# EAGLE design uBraids_SE_Main_Board (EAGLE 9.5.2)

## Sheet 1 of 2
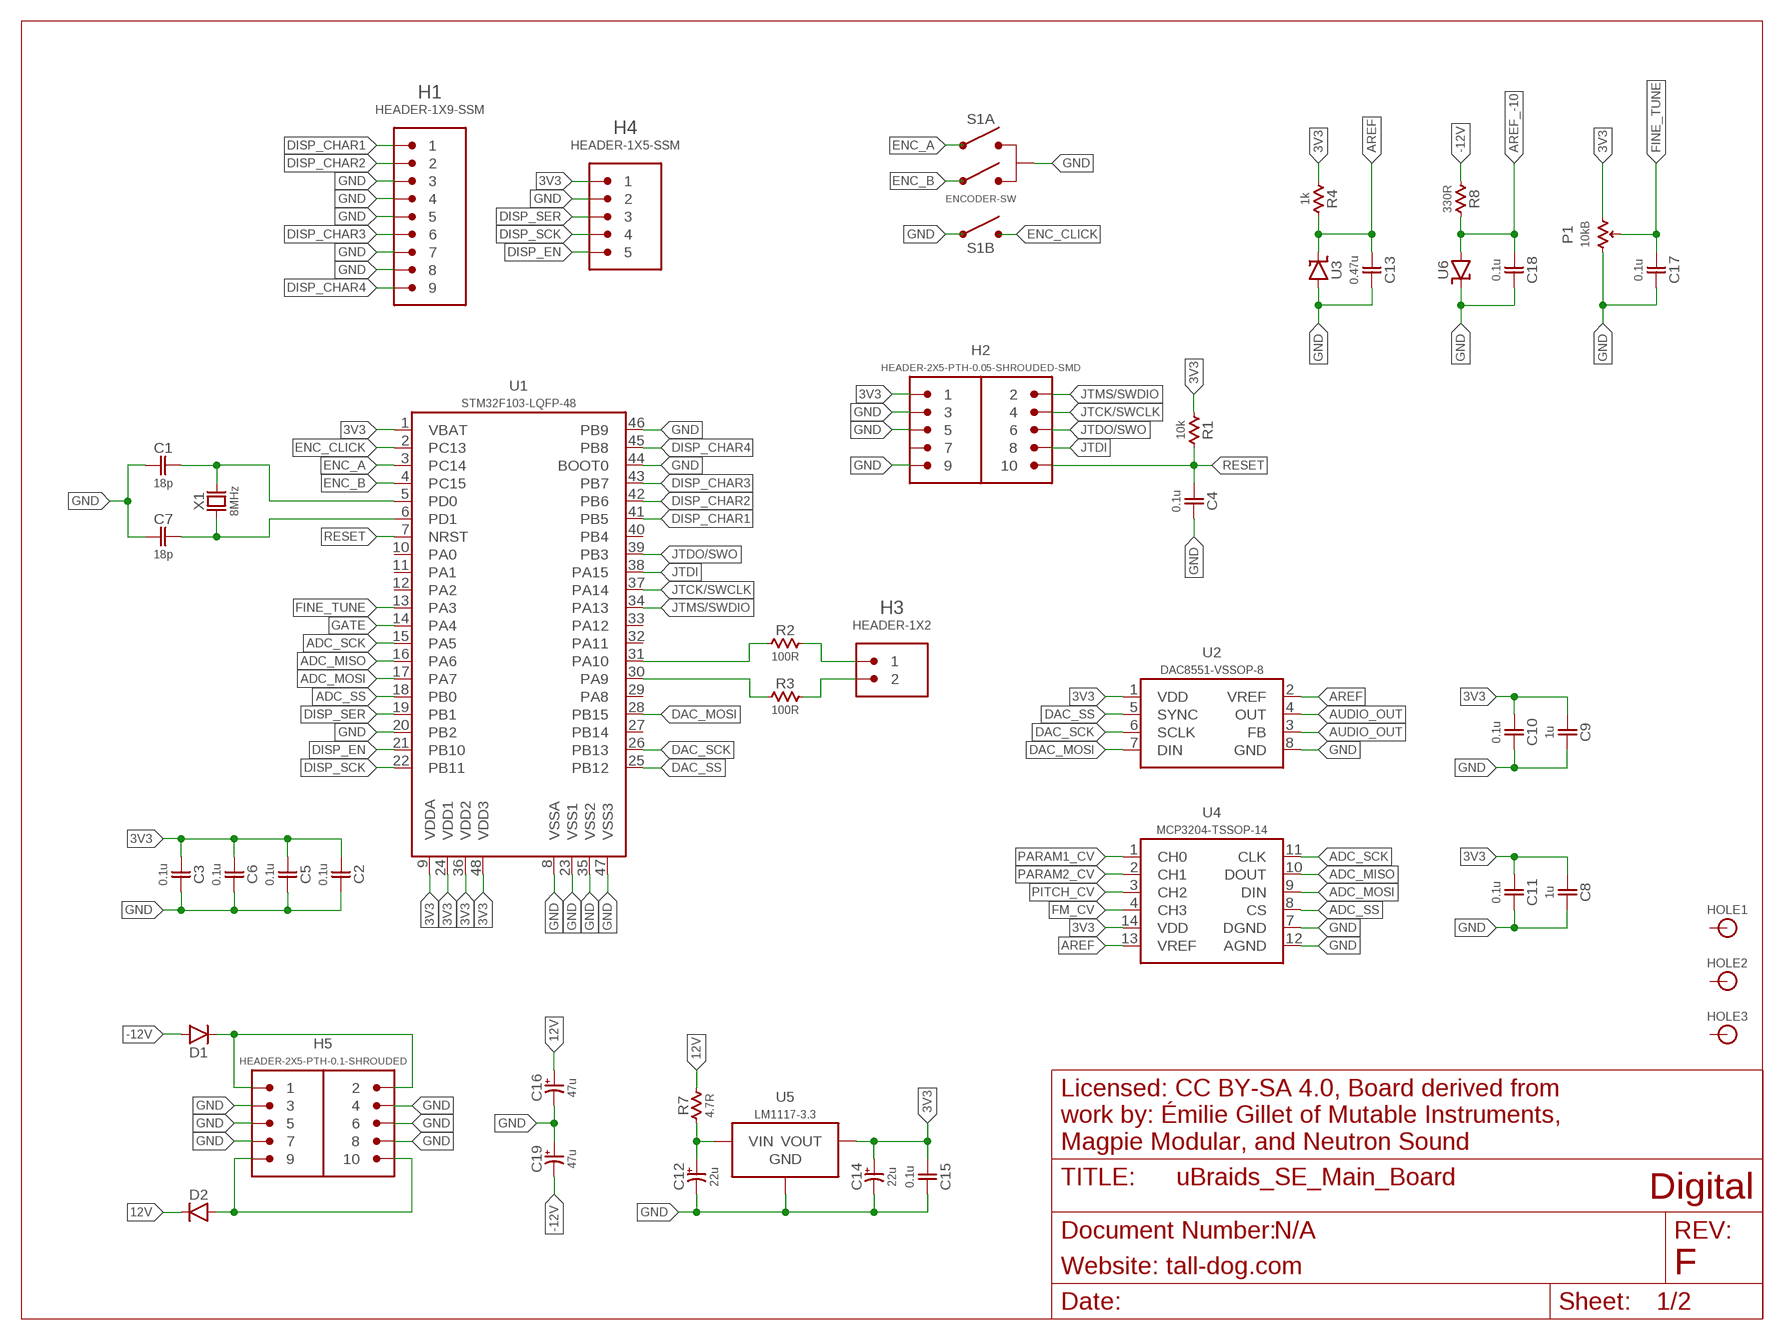
[diagram p0: schematic, sheet 1]

### Parts
C1  18p  CAP-NP-0603  [0603-NP]
C2  0.1u  CAP-NP-0603  [0603-NP]
C3  0.1u  CAP-NP-0603  [0603-NP]
C4  0.1u  CAP-NP-0603  [0603-NP]
C5  0.1u  CAP-NP-0603  [0603-NP]
C6  0.1u  CAP-NP-0603  [0603-NP]
C7  18p  CAP-NP-0603  [0603-NP]
C8  1u  CAP-NP-0603  [0603-NP]
C9  1u  CAP-NP-0603  [0603-NP]
C10  0.1u  CAP-NP-0603  [0603-NP]
C11  0.1u  CAP-NP-0603  [0603-NP]
C12  22u  CAP-P-6.6MM  [ELECTRO-SMD-6.6MM]
C13  0.47u  CAP-NP-0603  [0603-NP]
C14  22u  CAP-P-6.6MM  [ELECTRO-SMD-6.6MM]
C15  0.1u  CAP-NP-0603  [0603-NP]
C16  47u  CAP-P-6.6MM  [ELECTRO-SMD-6.6MM]
C17  0.1u  CAP-NP-0603  [0603-NP]
C18  0.1u  CAP-NP-0603  [0603-NP]
C19  47u  CAP-P-6.6MM  [ELECTRO-SMD-6.6MM]
D1  1N5819HW  DIODE-SOD123  [SOD-123]
D2  1N5819HW  DIODE-SOD123  [SOD-123]
H1  HEADER-1X9-SSM  [SSM-109-S-SV-BE]
H2  HEADER-2X5-PTH-0.05-SHROUDED-SMD  [PTH-0.05-2X5-SHROUDED-SMD]
H3  HEADER-1X2  [PTH-0.1-1X2]
H4  HEADER-1X5-SSM  [SSM-105-S-SV-BE]
H5  HEADER-2X5-PTH-0.1-SHROUDED  [PTH-0.1-2X5-SHROUDED]
HOLE1  HOLE  [M2.5-HOLE]
HOLE2  HOLE  [M2.5-HOLE]
HOLE3  HOLE  [M2.5-HOLE]
P1  10kB  POT-ALPS-VERT-PS  [POT]
R1  10k  RESISTOR-0603  [0603-NP]
R2  100R  RESISTOR-0603  [0603-NP]
R3  100R  RESISTOR-0603  [0603-NP]
R4  1k  RESISTOR-0603  [0603-NP]
R7  4.7R  RESISTOR-0805  [0805-NP]
R8  330R  RESISTOR-0805  [0805-NP]
S1  ENCODER-SW  [ENCODER-EC12E]
U1  STM32F103-LQFP-48  [LQFP-48]
U2  DAC8551-VSSOP-8  [VSSOP-8]
U3  LM4040B25  LM4041-SOT-23  [SOT-23]
U4  MCP3204-TSSOP-14  [TSSOP-14]
U5  LM1117-3.3  LM1117-SOT-223  [SOT-223]
U6  LM4040B10  LM4041-SOT-23  [SOT-23]
X1  8MHz  CRYSTAL-ABM2  [CRYSTAL-ABM2]

### Nets
3V3: C2.1 C3.1 C5.1 C6.1 C8.1 C9.1 C10.1 C11.1 C14.A(POS) C15.1 H2.1 H4.1 P1.P$1(E) R1.1 R4.1 U1.1(VBAT) U1.9(VDDA) U1.24(VDD1) U1.36(VDD2) U1.48(VDD3) U2.1(VDD) U4.14(VDD) U5.2(VOUT) U5.4(VOUT) ; also sheet 2
12V: C16.A(POS) D2.C R7.2 ; also sheet 2
12V_BUS: D2.A H5.9 H5.10
12V_U5: C12.A(POS) R7.1 U5.3(VIN)
-12V: C19.C(NEG) D1.A R8.1 ; also sheet 2
-12V_BUS: D1.C H5.1 H5.2
ADC_MISO: U1.16(PA6) U4.10(DOUT)
ADC_MOSI: U1.17(PA7) U4.9(DIN)
ADC_SCK: U1.15(PA5) U4.11(CLK)
ADC_SS: U1.18(PB0) U4.8(CS)
AREF: C13.1 R4.2 U2.2(VREF) U3.1(C) U4.13(VREF)
AREF_-10: C18.1 R8.2 U6.2(A) ; also sheet 2
AUDIO_OUT: U2.3(FB) U2.4(OUT) ; also sheet 2
DAC_MOSI: U1.28(PB15) U2.7(DIN)
DAC_SCK: U1.26(PB13) U2.6(SCLK)
DAC_SS: U1.25(PB12) U2.5(SYNC)
DISP_CHAR1: H1.1 U1.41(PB5)
DISP_CHAR2: H1.2 U1.42(PB6)
DISP_CHAR3: H1.6 U1.43(PB7)
DISP_CHAR4: H1.9 U1.45(PB8)
DISP_EN: H4.5 U1.21(PB10)
DISP_SCK: H4.4 U1.22(PB11)
DISP_SER: H4.3 U1.19(PB1)
ENC_A: S1.B(A:B) U1.3(PC14)
ENC_B: S1.A(A:A) U1.4(PC15)
ENC_CLICK: S1.E U1.2(PC13)
FINE_TUNE: C17.1 P1.P$2(S) U1.13(PA3)
FM_CV: U4.4(CH3) ; also sheet 2
GATE: U1.14(PA4) ; also sheet 2
GND: C1.1 C2.2 C3.2 C4.2 C5.2 C6.2 C7.1 C8.2 C9.2 C10.2 C11.2 C12.C(NEG) C13.2 C14.C(NEG) C15.2 C16.C(NEG) C17.2 C18.2 C19.A(POS) H1.3 H1.4 H1.5 H1.7 H1.8 H2.3 H2.5 H2.9 H4.2 H5.3 H5.4 H5.5 H5.6 H5.7 H5.8 P1.P$3(A) S1.C(A:C) S1.D U1.8(VSSA) U1.20(PB2) U1.23(VSS1) U1.35(VSS2) U1.44(BOOT0) U1.46(PB9) U1.47(VSS3) U2.8(GND) U3.2(A) U4.7(DGND) U4.12(AGND) U5.1(GND) U6.1(C) ; also sheet 2
JTCK/SWCLK: H2.4 U1.37(PA14)
JTDI: H2.8 U1.38(PA15)
JTDO/SWO: H2.6 U1.39(PB3)
JTMS/SWDIO: H2.2 U1.34(PA13)
PARAM1_CV: U4.1(CH0) ; also sheet 2
PARAM2_CV: U4.2(CH1) ; also sheet 2
PD0-XTAL: C1.2 U1.5(PD0) X1.2
PD1-XTAL: C7.2 U1.6(PD1) X1.1
PITCH_CV: U4.3(CH2) ; also sheet 2
RESET: C4.1 H2.10 R1.2 U1.7(NRST)
RX: H3.1 R2.2
RX_R: R2.1 U1.31(PA10)
TX: H3.2 R3.2
TX_R: R3.1 U1.30(PA9)
Unconnected: H2.7 HOLE1.P$1 HOLE1.P$2 HOLE1.P$3 HOLE1.P$4 HOLE1.P$5 HOLE1.P$6 HOLE1.P$7 HOLE1.P$8 HOLE1.P$9 HOLE2.P$1 HOLE2.P$2 HOLE2.P$3 HOLE2.P$4 HOLE2.P$5 HOLE2.P$6 HOLE2.P$7 HOLE2.P$8 HOLE2.P$9 HOLE3.P$1 HOLE3.P$2 HOLE3.P$3 HOLE3.P$4 HOLE3.P$5 HOLE3.P$6 HOLE3.P$7 HOLE3.P$8 HOLE3.P$9 U1.10(PA0) U1.11(PA1) U1.12(PA2) U1.27(PB14) U1.29(PA8) U1.32(PA11) U1.33(PA12) U1.40(PB4)

### Notes on the sheet
- Licensed: CC BY-SA 4.0, Board derived from
  work by: Émilie Gillet of Mutable Instruments,
  Magpie Modular, and Neutron Sound
- Digital
- N/A
- Website: tall-dog.com | F

## Sheet 2 of 2
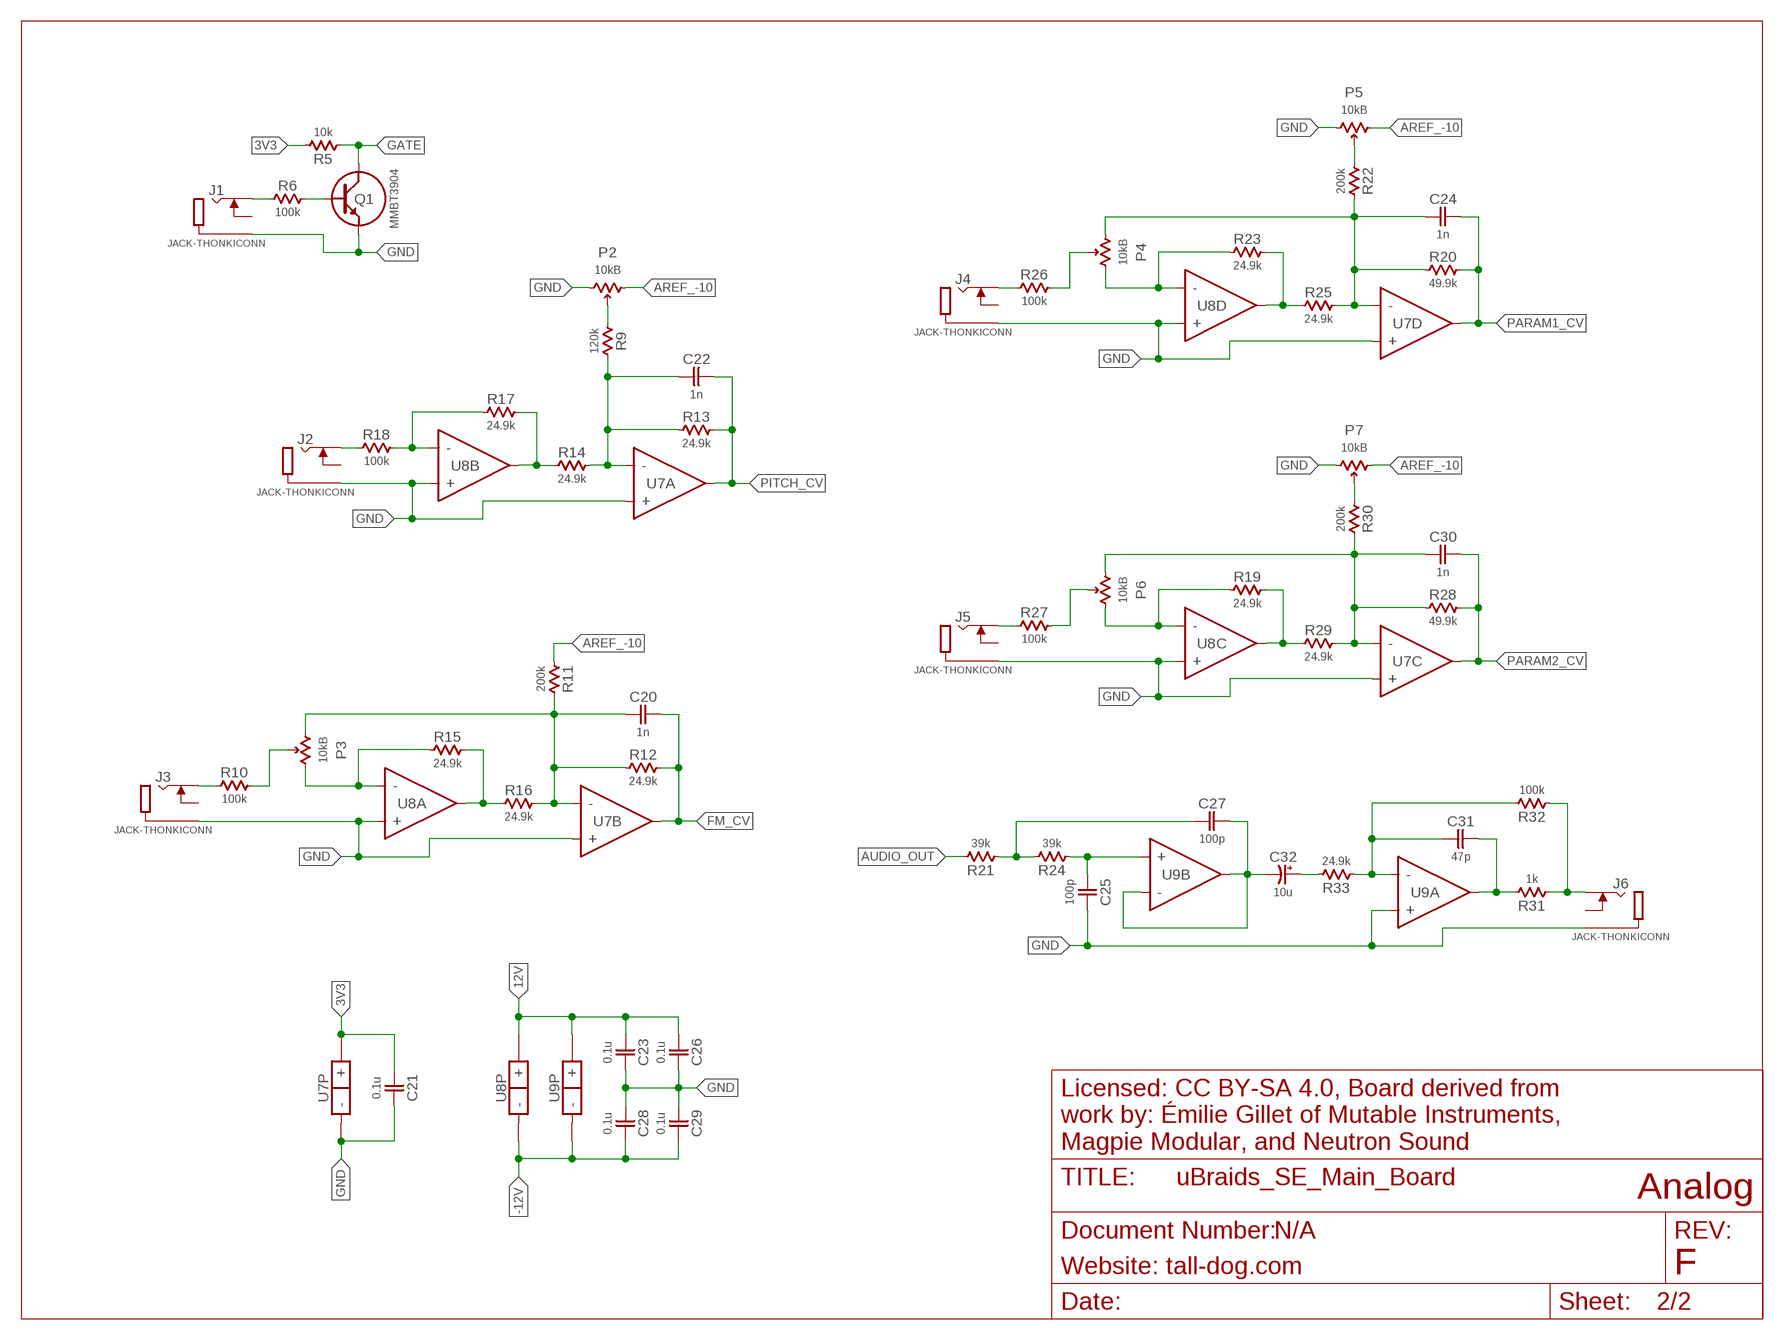
[diagram p1: schematic, sheet 2]

### Parts
C20  1n  CAP-NP-0603  [0603-NP]
C21  0.1u  CAP-NP-0603  [0603-NP]
C22  1n  CAP-NP-0603  [0603-NP]
C23  0.1u  CAP-NP-0603  [0603-NP]
C24  1n  CAP-NP-0603  [0603-NP]
C25  100p  CAP-NP-0603  [0603-NP]
C26  0.1u  CAP-NP-0603  [0603-NP]
C27  100p  CAP-NP-0603  [0603-NP]
C28  0.1u  CAP-NP-0603  [0603-NP]
C29  0.1u  CAP-NP-0603  [0603-NP]
C30  1n  CAP-NP-0603  [0603-NP]
C31  47p  CAP-NP-0603  [0603-NP]
C32  10u  CAP-P-4.3MM  [ELECTRO-SMD-4.3MM]
J1  JACK-THONKICONN  [THONKICONN]
J2  JACK-THONKICONN  [THONKICONN]
J3  JACK-THONKICONN  [THONKICONN]
J4  JACK-THONKICONN  [THONKICONN]
J5  JACK-THONKICONN  [THONKICONN]
J6  JACK-THONKICONN  [THONKICONN]
P2  10kB  POT-ALPS-VERT-PS  [POT]
P3  10kB  POT-ALPS-VERT-PS  [POT]
P4  10kB  POT-ALPS-VERT-PS  [POT]
P5  10kB  POT-ALPS-VERT-PS  [POT]
P6  10kB  POT-ALPS-VERT-PS  [POT]
P7  10kB  POT-ALPS-VERT-PS  [POT]
Q1  MMBT3904  NPN-SOT23-BEC  [SOT-23]
R5  10k  RESISTOR-0603  [0603-NP]
R6  100k  RESISTOR-0603  [0603-NP]
R9  120k  RESISTOR-0603  [0603-NP]
R10  100k  RESISTOR-0603  [0603-NP]
R11  200k  RESISTOR-0603  [0603-NP]
R12  24.9k  RESISTOR-0603  [0603-NP]
R13  24.9k  RESISTOR-0603  [0603-NP]
R14  24.9k  RESISTOR-0603  [0603-NP]
R15  24.9k  RESISTOR-0603  [0603-NP]
R16  24.9k  RESISTOR-0603  [0603-NP]
R17  24.9k  RESISTOR-0603  [0603-NP]
R18  100k  RESISTOR-0603  [0603-NP]
R19  24.9k  RESISTOR-0603  [0603-NP]
R20  49.9k  RESISTOR-0603  [0603-NP]
R21  39k  RESISTOR-0603  [0603-NP]
R22  200k  RESISTOR-0603  [0603-NP]
R23  24.9k  RESISTOR-0603  [0603-NP]
R24  39k  RESISTOR-0603  [0603-NP]
R25  24.9k  RESISTOR-0603  [0603-NP]
R26  100k  RESISTOR-0603  [0603-NP]
R27  100k  RESISTOR-0603  [0603-NP]
R28  49.9k  RESISTOR-0603  [0603-NP]
R29  24.9k  RESISTOR-0603  [0603-NP]
R30  200k  RESISTOR-0603  [0603-NP]
R31  1k  RESISTOR-0603  [0603-NP]
R32  100k  RESISTOR-0603  [0603-NP]
R33  24.9k  RESISTOR-0603  [0603-NP]
U7  MCP6004  TL074-TSSOP-14  [TSSOP-14]
U8  TL074-TSSOP-14  [TSSOP-14]
U9  TL072  TL072-TSSOP-8  [TSSOP-8]

### Nets
3V3: C21.1 R5.2 U7.4(P:+) ; also sheet 1
12V: C23.1 C26.1 U8.4(P:+) U9.8(P:+) ; also sheet 1
-12V: C28.2 C29.2 U8.11(P:-) U9.4(P:-) ; also sheet 1
AREF_-10: P2.P$1(E) P5.P$1(E) P7.P$1(E) R11.1 ; also sheet 1
AUDIO_OUT: R21.2 ; also sheet 1
FM_CV: C20.2 R12.2 U7.7(B:OUT) ; also sheet 1
GATE: Q1.3(C) R5.1 ; also sheet 1
GND: C21.2 C23.2 C25.2 C26.2 C28.1 C29.1 J1.P1 J2.P1 J3.P1 J4.P1 J5.P1 J6.P1 P2.P$3(A) P5.P$3(A) P7.P$3(A) Q1.2(E) U7.3(A:+) U7.5(B:+) U7.10(C:+) U7.11(P:-) U7.12(D:+) U8.3(A:+) U8.5(B:+) U8.10(C:+) U8.12(D:+) U9.3(A:+) ; also sheet 1
N$1: P6.P$2(S) R27.2
N$3: C24.1 P4.P$3(A) R20.1 R22.2 R25.2 U7.13(D:-)
N$12: R14.1 R17.2 U8.7(B:OUT)
N$13: P2.P$2(S) R9.1
N$14: J2.P3 R18.1
N$29: C22.1 R9.2 R13.1 R14.2 U7.2(A:-)
N$45: R17.1 R18.2 U8.6(B:-)
N$46: J3.P3 R10.1
N$47: J4.P3 R26.1
N$48: P3.P$2(S) R10.2
N$50: P4.P$1(E) R23.1 U8.13(D:-)
N$51: R23.2 R25.1 U8.14(D:OUT)
N$52: P3.P$1(E) R15.1 U8.2(A:-)
N$53: R15.2 R16.1 U8.1(A:OUT)
N$55: C20.1 P3.P$3(A) R11.2 R12.1 R16.2 U7.6(B:-)
N$57: J1.P3 R6.1
N$58: R19.2 R29.1 U8.8(C:OUT)
N$60: J5.P3 R27.1
N$61: P5.P$2(S) R22.1
N$62: P4.P$2(S) R26.2
N$63: P6.P$1(E) R19.1 U8.9(C:-)
N$65: P7.P$2(S) R30.1
N$66: Q1.1(B) R6.2
N$67: C27.2 C32.C(NEG) U9.6(B:-) U9.7(B:OUT)
N$68: C32.A(POS) R33.2
N$69: C25.1 R24.1 U9.5(B:+)
N$70: C30.1 P6.P$3(A) R28.1 R29.2 R30.2 U7.9(C:-)
N$71: C27.1 R21.1 R24.2
N$72: J6.P3 R31.1 R32.1
N$73: C31.2 R31.2 U9.1(A:OUT)
N$75: C31.1 R32.2 R33.1 U9.2(A:-)
PARAM1_CV: C24.2 R20.2 U7.14(D:OUT) ; also sheet 1
PARAM2_CV: C30.2 R28.2 U7.8(C:OUT) ; also sheet 1
PITCH_CV: C22.2 R13.2 U7.1(A:OUT) ; also sheet 1
Unconnected: J1.P2 J2.P2 J3.P2 J4.P2 J5.P2 J6.P2

### Notes on the sheet
- Licensed: CC BY-SA 4.0, Board derived from
  work by: Émilie Gillet of Mutable Instruments,
  Magpie Modular, and Neutron Sound
- Analog
- N/A
- Website: tall-dog.com | F

## Library data of the parts
C1-C11 C13 C15 C17 C18 C20-C31 = uBraids_SE_Library:CAP-NP
C12 C14 C16 C19 C32 = uBraids_SE_Library:CAP-P
D1 D2 = uBraids_SE_Library:DIODE
H1 = uBraids_SE_Library:HEADER-1X9
H2 H5 = uBraids_SE_Library:HEADER-2X5
H3 = uBraids_SE_Library:HEADER-1X2
H4 = uBraids_SE_Library:HEADER-1X5
HOLE1-HOLE3 = uBraids_SE_Library:HOLE
J1-J6 = uBraids_SE_Library:JACK
P1-P7 = uBraids_SE_Library:POT
Q1 = uBraids_SE_Library:NPN
R1-R33 = uBraids_SE_Library:RESISTOR
S1 = uBraids_SE_Library:ENCODER-SW: ALPS rotary Encoder EC12E series with switch
U1 = uBraids_SE_Library:STM32F103
U2 = uBraids_SE_Library:DAC8551
U3 U6 = uBraids_SE_Library:LM4041: PRECISION MICROPOWER SHUNT VOLTAGE REFERENCE Source: http://focus.ti.com/lit/ds/slcs146e/slcs146e.pdf
U4 = uBraids_SE_Library:MCP3204
U5 = uBraids_SE_Library:LM1117: 800mA and 1A Low Dropout (LDO) Positive Regulator 1.8V, 2.5V, 2.85V, 3.3V, 5V, and Adj
U7 U8 = uBraids_SE_Library:TL074: OP AMP
U9 = uBraids_SE_Library:TL072: OP AMP
X1 = uBraids_SE_Library:CRYSTAL

## Net classes
0 default: clearance 0.205 mm

## Board
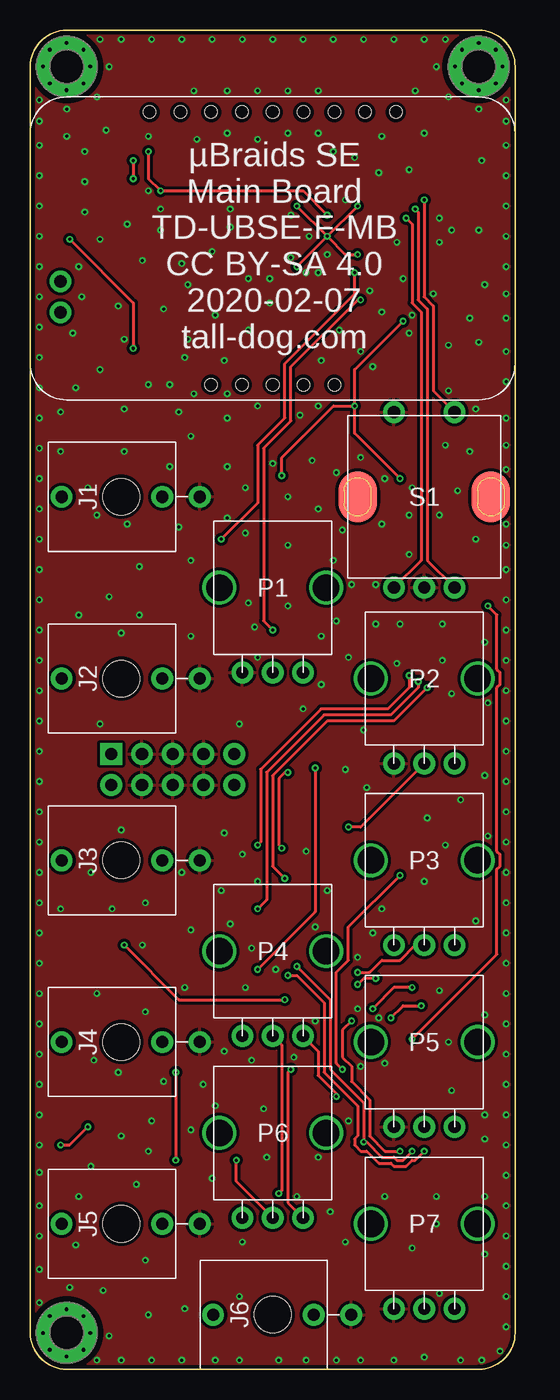
[diagram p2: board, top side]
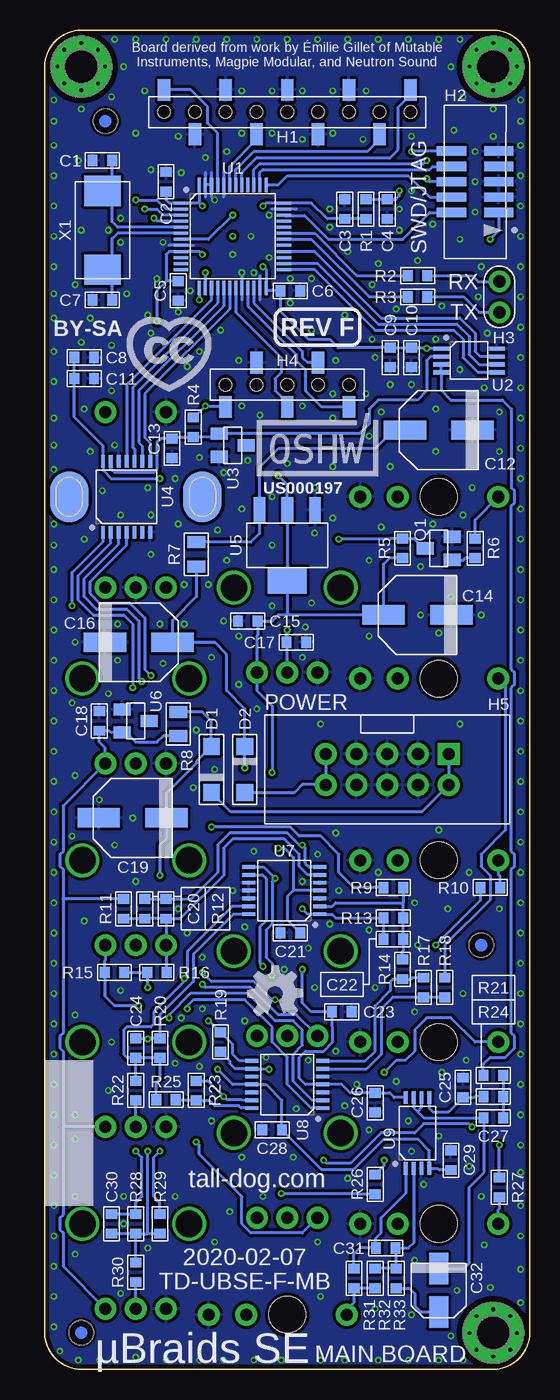
[diagram p3: board, bottom side, seen from below]

Size 40 x 110.5 mm. Coordinates in mm from the lower left corner, seen from the top.
Outline: 3,0 37,0 arc90 40,3 40,107.5 arc90 37,110.5 3,110.5 arc90 0,107.5 0,3 arc90 3,0
Copper layers (1*16): Top 0.035mm / dielectric 1.5mm / Bottom 0.035mm
Design rules "default *": minimum track width 0.25mm, minimum drill 0.25mm, track to track 6mil, track to pad 6mil, pad to pad 6mil, via to via 6mil, smd to smd 0mil, copper to edge 12.5mil, drill to drill 8mil, minimum pad ring 6mil, minimum via ring 6mil, stop-mask expansion 0mil, vias tented up to drill 0.25mm, thermal gap 10mil

### Footprints (pad centres in the part's own frame; a part is rotated, then mirrored left to right if it is on the bottom)
0603-NP = smd 0.81 x 0.93: 1 -0.81,0; 2 0.81,0
ELECTRO-SMD-6.6MM = smd 3.5 x 1.6: A 2.8,0; C -2.8,0
ELECTRO-SMD-4.3MM = smd 2.6 x 1.6: A 1.8,0; C -1.8,0
SOD-123 = smd 1.4 x 1.4: A 1.9,0; C -1.9,0
SSM-109-S-SV-BE = smd 1.02 x 1.805: 1 0,-1.827; 2 2.54,1.827; 3 5.08,-1.827; 4 7.62,1.827; 5 10.16,-1.827; 6 12.7,1.827; 7 15.24,-1.827; 8 17.78,1.827; 9 20.32,-1.827 | hole 1.02: 0,0; 2.54,0; 5.08,0; 7.62,0; 10.16,0; 12.7,0; 15.24,0; 17.78,0; 20.32,0
PTH-0.05-2X5-SHROUDED-SMD = smd 2.4 x 0.76: 1 -1.95,2.54; 2 1.95,2.54; 3 -1.95,1.27; 4 1.95,1.27; 5 -1.95,0; 6 1.95,0; 7 -1.95,-1.27; 8 1.95,-1.27; 9 -1.95,-2.54; 10 1.95,-2.54
PTH-0.1-1X2 = drill 1.016 pad 1.778: 1 -1.27,0; 2 1.27,0
SSM-105-S-SV-BE = smd 1.02 x 1.805: 1 0,-1.827; 2 2.54,1.827; 3 5.08,-1.827; 4 7.62,1.827; 5 10.16,-1.827 | hole 1.02: 0,0; 2.54,0; 5.08,0; 7.62,0; 10.16,0
PTH-0.1-2X5-SHROUDED = drill 1 pad 1.8 square: 1 -1.27,5.08 | drill 1 pad 1.8: 2 1.27,5.08; 3 -1.27,2.54; 4 1.27,2.54; 5 -1.27,0; 6 1.27,0; 7 -1.27,-2.54; 8 1.27,-2.54; 9 -1.27,-5.08; 10 1.27,-5.08
M2.5-HOLE = drill 2.75 pad 5: P$1 0,0 | drill 0.3: P$2 0,1.95; P$3 0,-1.95; P$4 -1.95,0; P$5 1.95,0; P$6 1.4,1.4; P$7 -1.4,1.4; P$8 -1.4,-1.4; P$9 1.4,-1.4
THONKICONN = drill 1 pad 1.8: P1 0,-6.48; P2 0,-3.38; P3 0,4.92 | hole 3: 0,0
POT = drill 1 pad 1.8: P$1 -2.5,7; P$2 0,7; P$3 2.5,7 | drill 2.2 pad 2.8: P$4 -4.4,0; P$5 4.4,0
SOT-23 = smd 1 x 1.4: 1 -0.95,-1.1; 2 0.95,-1.1; 3 0,1.1
0805-NP = smd 1 x 1.5: 1 -1,0; 2 1,0
ENCODER-EC12E = drill 1 pad 1.8: A -2.5,-7.5; B 2.5,-7.5; C 0,-7.5; D -2.5,7; E 2.5,7 | smd 3.2 x 4.2 bottom: G1B -5.5,0; G2B 5.5,0 | smd 3.2 x 4.2: G1T -5.5,0; G2T 5.5,0
LQFP-48 = smd 0.25 x 1.2: 1 -2.75,-4.25; 2 -2.25,-4.25; 3 -1.75,-4.25; 4 -1.25,-4.25; 5 -0.75,-4.25; 6 -0.25,-4.25; 7 0.25,-4.25; 8 0.75,-4.25; 9 1.25,-4.25; 10 1.75,-4.25; 11 2.25,-4.25; 12 2.75,-4.25; 25 2.75,4.25; 26 2.25,4.25; 27 1.75,4.25; 28 1.25,4.25; 29 0.75,4.25; 30 0.25,4.25; 31 -0.25,4.25; 32 -0.75,4.25; 33 -1.25,4.25; 34 -1.75,4.25; 35 -2.25,4.25; 36 -2.75,4.25 | smd 1.2 x 0.25: 13 4.25,-2.75; 14 4.25,-2.25; 15 4.25,-1.75; 16 4.25,-1.25; 17 4.25,-0.75; 18 4.25,-0.25; 19 4.25,0.25; 20 4.25,0.75; 21 4.25,1.25; 22 4.25,1.75; 23 4.25,2.25; 24 4.25,2.75; 37 -4.25,2.75; 38 -4.25,2.25; 39 -4.25,1.75; 40 -4.25,1.25; 41 -4.25,0.75; 42 -4.25,0.25; 43 -4.25,-0.25; 44 -4.25,-0.75; 45 -4.25,-1.25; 46 -4.25,-1.75; 47 -4.25,-2.25; 48 -4.25,-2.75
VSSOP-8 = smd 0.35 x 1.3: 1 -0.975,-2.3; 2 -0.325,-2.3; 3 0.325,-2.3; 4 0.975,-2.3; 5 0.975,2.3; 6 0.325,2.3; 7 -0.325,2.3; 8 -0.975,2.3
TSSOP-14 = smd 0.32 x 1.05: 1 -1.95,-2.925; 2 -1.3,-2.925; 3 -0.65,-2.925; 4 0,-2.925; 5 0.65,-2.925; 6 1.3,-2.925; 7 1.95,-2.925; 8 1.95,2.925; 9 1.3,2.925; 10 0.65,2.925; 11 0,2.925; 12 -0.65,2.925; 13 -1.3,2.925; 14 -1.95,2.925
SOT-223 = smd 0.95 x 2.15: 1 -2.3,-2.9; 2 0,-2.9; 3 2.3,-2.9 | smd 3.25 x 2.15: 4 0,2.9
TSSOP-8 = smd 0.32 x 1.05: 1 -0.975,-2.925; 2 -0.325,-2.925; 3 0.325,-2.925; 4 0.975,-2.925; 5 0.975,2.925; 6 0.325,2.925; 7 -0.325,2.925; 8 -0.975,2.925
CRYSTAL-ABM2 = smd 2.5 x 3: 1 -3.25,0; 2 3.25,0

### Placement (x,y rotation side)
A1  [DISPLAY-MODULE-OUTLINE]  0,80 0 top
C1  35.25,99.75 0 bottom
C2  30,98 90 bottom
C3  15.25,95.75 90 bottom
C4  11.75,95.75 270 bottom
C5  29,89 270 bottom
C6  19.75,89 0 bottom
C7  35.25,88.25 0 bottom
C8  36.75,83.5 0 bottom
C9  11.5,83.5 270 bottom
C10  9.75,83.5 270 bottom
C11  36.75,81.75 0 bottom
C12  7.5,77.5 180 bottom
C13  29.5,76 270 bottom
C14  9.25,62.25 180 bottom
C15  23.25,61.75 180 bottom
C16  32.25,60 0 bottom
C17  19.25,60 0 bottom
C18  35.5,53.5 90 bottom
C19  32.75,45.5 180 bottom
C20  31.75,38 90 bottom
C21  19.75,36 180 bottom
C22  11.25,35.5 180 bottom
C23  15.5,29.5 0 bottom
C24  32.5,26.5 90 bottom
C25  5.5,23.25 90 bottom
C26  12.75,22 270 bottom
C27  3,20.75 180 bottom
C28  21.25,19.75 0 bottom
C29  6.5,17.25 270 bottom
C30  34.5,12 90 bottom
C31  11.88,10 180 bottom
C32  7.5,6.5 270 bottom
D1  26.25,49.5 90 bottom
D2  23.5,49.5 270 bottom
H1  9.84,103.75 180 bottom
H2  4.5,98 180 bottom
H3  2.5,88.5 270 bottom
H4  25.08,81.25 0 bottom
H5  11.75,49.5 270 bottom
HOLE1  3,107.5 0 top
HOLE2  37,107.5 0 top
HOLE3  3,3 0 top
J1  7.5,72 90 top
J2  7.5,57 90 top
J3  7.5,42 90 top
J4  7.5,27 90 top
J5  7.5,12 90 top
J6  20,4.5 90 top
P1  20,64.5 180 top
P2  32.5,57 180 top
P3  32.5,42 180 top
P4  20,34.5 180 top
P5  32.5,27 180 top
P6  20,19.5 180 top
P7  32.5,12 180 top
Q1  7.5,67.75 90 bottom
R1  13.5,95.75 90 bottom
R2  9.25,90.25 0 bottom
R3  9.25,88.5 0 bottom
R4  27.75,77.75 270 bottom
R5  10.5,67.75 270 bottom
R6  4.5,67.75 270 bottom
R7  27.5,67.25 270 bottom
R8  29,53.25 270 bottom
R9  11.25,39.75 0 bottom
R10  3.25,39.75 180 bottom
R11  33.5,38 270 bottom
R12  30,38 90 bottom
R13  11.25,37.25 180 bottom
R14  10.5,33 90 bottom
R15  34.25,32.75 0 bottom
R16  30.75,32.75 0 bottom
R17  8.75,31.5 90 bottom
R18  7,31.5 270 bottom
R19  25.5,27 90 bottom
R20  30.5,26.5 90 bottom
R21  3,24.25 180 bottom
R22  32.5,23 90 bottom
R23  27.5,23 270 bottom
R24  3,22.5 0 bottom
R25  30,22.25 180 bottom
R26  12.75,15.25 270 bottom
R27  2.5,15 90 bottom
R28  32.5,12 90 bottom
R29  30.5,12 270 bottom
R30  32.5,8 90 bottom
R31  14.5,7.5 90 bottom
R32  12.75,7.5 90 bottom
R33  11,7.5 270 bottom
S1  32.5,72 0 top
U1  24.5,93.5 270 bottom
U2  5,83.25 270 bottom
U3  24.5,76.25 270 bottom
U4  33.25,72 0 bottom
U5  20,68 180 bottom
U6  32.5,53.5 270 bottom
U7  20.25,39.5 90 bottom
U8  20,23.5 90 bottom
U9  9.25,19.5 0 bottom
U$1  [FIDUCIAL]  35,103 0 bottom
U$2  [LOGO-REV]  17.5,86 0 bottom
U$3  [LOGO-OSH]  21,31 0 bottom
U$4  [LOGO-CC]  29.75,83.75 0 bottom
U$6  [FIDUCIAL]  4,35 0 bottom
U$7  [FIDUCIAL]  37,3 0 bottom
U$8  [LOGO-OSHW]  17.5,76 0 bottom
X1  35.25,94 90 bottom

### Tracks (layer width: path | path; a pad name or v marks a point on that pad's centre or on a via)
3V3  (via drill 0.25)
  Top 0.25: v22,96 v24.5,93.5 | v24.5,93.5 v22,91 | v24.5,93.5 26,92 v27,92 | v24.5,93.5 v27,96 | v21.25,49.25 21,49.25 20.5,48.75 20.5,43.25 v20.75,43 | v20.75,73.75 20.75,75.25 25,79.5 v26.75,79.5 | v26.75,79.5 26.75,77.25 v30.5,73.5 | v26.75,79.5 26.75,82.5 v30.75,86.5 | v3.25,93.25 8.5,88 v8.5,84.25
  Bottom 0.25: v22,96 21.75,96.25 U1.36 18,96.25 16.69,94.94 C3.1 R1.1 | U1.48 27.25,96.25 | v27,96 27.25,96.25 | 27.25,96.25 U1.1 29.75,96.25 30,96.5 C2.1 | v27,92 27.25,92.25 U1.9 29.75,92.25 30,92 30,89.81 | 30,89.81 30,89.75 30.75,89 v30.75,86.5 | v22,91 21.75,90.75 U1.24 21.75,89 C6.1 20.56,87.31 18.25,85 16.5,85 15.81,84.31 C9.1 C10.1 8.56,84.31 v8.5,84.25 8.47,84.22 U2.1 | 20,62.25 C14.A 12.05,66.45 11.56,66.94 R5.2 | 20,62.25 20.75,62.25 21.25,61.75 C15.1 22.44,60.56 22.5,60.5 P1.P$1 22.5,56 21.25,54.75 v21.25,49.25 | U7.4 19.5,39.5 | 19.5,39.5 20,39 20,37.06 C21.1 | v20.75,43 20.25,43 19.5,42.25 19.5,39.5 | 20,62.25 U5.4 U5.2 20,73 v20.75,73.75 | C5.1 30,89.81 | H2.1 2.55,93.95 v3.25,93.25 | H4.1 25.16,79.5 v26.75,79.5 27.69,78.56 R4.1 | v30.5,73.5 34.5,73.5 35.2,74.2 U4.14 35.2,76.2 37.56,78.56 C11.1 C8.1
12V  (via drill 0.25)
  Top 0.25: v23.5,49.62 23.5,37.75 v18.75,33
  Bottom 0.25: v23.5,49.62 D2.C 23.5,54.5 25,56 25,59 26,60 C16.A 29.45,61.8 27.5,63.75 R7.2 | v18.75,33 18.75,30.25 18,29.5 C23.1 16.31,28.31 16.25,28.25 16.25,27 17,26.25 18.5,26.25 19,25.75 19,24 18.5,23.5 U8.4 15.5,23.5 14.81,22.81 C26.1 11.56,22.81 11.18,22.43 U9.8
12V_BUS
  Bottom 0.25: D2.A 19.4,47.6 18.75,48.25 16.85,48.25 H5.10 H5.9
12V_U5
  Bottom 0.25: C12.A 11.2,77.5 12.7,76 20.7,76 22.3,74.4 U5.3 22.3,68.95 23,68.25 R7.1
-12V  (via drill 0.25)
  Top 0.25: v25.75,24.75 25.25,25.25 25.25,32.75 26.25,33.75 26.25,36.5 v30.5,40.75
  Bottom 0.25: R8.1 27,54.25 26.25,53.5 D1.A 27.5,50.15 27.5,50 29.95,47.55 C19.C 29.95,43.8 30.5,43.25 v30.5,40.75 | v25.75,24.75 24.5,23.5 U8.11 21.75,23.5 20.44,22.19 C28.2 17.19,16.5 14.5,16.5 12,19 9.25,19 8.28,18.02 U9.4 7.58,16.57 7.44,16.44 C29.2
-12V_BUS
  Bottom 0.25: D1.C 24.65,46 8.9,46 H5.2 H5.1
ADC_MISO
  Bottom 0.25: U1.16 25.75,88 32.75,81 32.75,76.08 32.6,75.92 U4.10
ADC_MOSI
  Bottom 0.25: U1.17 25.25,87.75 32.25,80.75 32.25,76.47 31.95,76.17 U4.9
ADC_SCK
  Bottom 0.25: U1.15 26.25,88.25 33.25,81.25 U4.11
ADC_SS
  Bottom 0.25: U1.18 24.75,87.5 31.75,80.5 31.75,76.88 31.3,76.42 U4.8
AREF
  Bottom 0.25: U4.13 34.55,74.3 34.25,74 31,74 30.75,74.25 30.75,76.5 30.44,76.81 C13.1 29.37,76.94 R4.2 25.85,76.95 U3.1 25.55,77.25 14,77.25 13.25,78 13.25,79.25 12.5,80 9.25,80 8.5,80.75 8.5,83.25 8.18,83.58 U2.2
AREF_-10
  Bottom 0.25: R8.2 30.25,52.25 30.75,51.75 32.5,51.75 33.3,52.55 U6.2 34.55,52.55 34.69,52.69 C18.1 35.5,51.75 35,51.25 P2.P$1 38.5,46.5 38.5,42.75 38.75,42.5 38.75,41.5 38.5,41.25 38.5,38.81 | 38.5,38.81 38.5,27.75 38.75,27.5 38.75,26.5 38.5,26.25 38.5,20 | 38.5,20 38.5,12.75 38.75,12.5 38.75,11.5 38.5,11.25 38.5,8.5 P7.P$1 | P5.P$1 38.5,20 | R11.1 38.5,38.81
AUDIO_OUT
  Bottom 0.25: U2.3 U2.4 7.3,80.8 6.5,80 2.25,80 1.5,79.25 1.5,72.75 1.25,72.5 1.25,71.5 1.5,71.25 1.5,57.75 1.25,57.5 1.25,56.5 1.5,56.25 1.5,42.75 1.25,42.5 1.25,41.5 1.5,41.25 1.5,27.75 1.25,27.5 1.25,26.5 2,25.75 3.25,25.75 3.81,25.19 R21.2
DAC_MOSI
  Bottom 0.25: U2.7 4.08,83.58 4.5,84 4.5,85.5 5.75,86.75 12.25,86.75 17.75,92.25 U1.28
DAC_SCK
  Bottom 0.25: U2.6 4.17,82.92 5,83.75 5,85.25 6,86.25 12.5,86.25 17.5,91.25 U1.26
DAC_SS
  Bottom 0.25: U2.5 4.28,82.28 5.5,83.5 5.5,85 6.25,85.75 12.75,85.75 17.75,90.75 U1.25
DISP_CHAR1
  Bottom 0.25: U1.41 23.75,98.75 22.5,100 11.5,100 10.85,100.65 10.85,104.15 9.84,105.16 H1.1
DISP_CHAR2
  Bottom 0.25: U1.42 24.25,99 22.75,100.5 13.4,100.5 12.38,101.52 H1.2
DISP_CHAR3
  Bottom 0.25: U1.43 24.75,99.25 22.54,101.46 H1.6
DISP_CHAR4
  Bottom 0.25: U1.45 25.75,102 26.57,102.83 26.57,104.17 27.98,105.58 H1.9
DISP_EN
  Bottom 0.25: U1.21 23.25,87.75 19.25,83.75 19.25,83.25 18.5,82.5 18.5,80.75 17.17,79.42 H4.5
DISP_SCK
  Bottom 0.25: U1.22 22.75,88 18.75,84 18.75,83.5 18.33,83.08 H4.4
DISP_SER
  Bottom 0.25: U1.19 24.25,87.25 20.5,83.5 20.5,82.25 21,81.75 21,80.75 20,79.75 H4.3
ENC_A  (via drill 0.25)
  Top 0.25: S1.B 32.75,66.75 32.75,87.5 32,88.25 32,95.5 v31.75,95.75
  Bottom 0.25: U1.3 30.25,95.25 30.75,95.75 v31.75,95.75
ENC_B  (via drill 0.25)
  Top 0.25: S1.A 32.25,66.75 32.25,87.25 31.5,88 31.5,94.5 v31,95
  Bottom 0.25: U1.4 30.75,94.75 v31,95
ENC_CLICK  (via drill 0.25)
  Top 0.25: v32.5,96.5 32.5,88.5 33.25,87.75 33.25,80.75 S1.E
  Bottom 0.25: U1.2 30,95.75 30.75,96.5 v32.5,96.5
FINE_TUNE  (via drill 0.25)
  Top 0.25: v27.25,88.25 27,88.25 21.5,82.75 21.5,78.25 19.25,76 19.25,61.75 v20,61
  Bottom 0.25: U1.13 v27.25,88.25 | v20,61 20.06,60.94 C17.1 20.06,57.56 P1.P$2
FM_CV  (via drill 0.25)
  Top 0.25: v31.25,57.25 31.25,56.25 29.5,54.5 24,54.5 19,49.5 19,43.5 v18.75,43.25
  Bottom 0.25: v31.25,57.25 31.75,57.75 31.75,62 33,63.25 35.5,63.25 36.25,64 36.25,65 33.25,68 U4.4 | U7.7 18.2,41.45 18.5,41.75 18.5,43 v18.75,43.25 19,43.25 20,44.25 24.75,44.25 25.75,43.25 25.75,41 27.94,38.81 R12.2 C20.2
GATE  (via drill 0.25)
  Top 0.25: v26.75,90.5 26.75,88.75 21,83 21,78.5 18.75,76.25 18.75,71.5 v15.75,68.5
  Bottom 0.25: v26.75,90.5 U1.14 | Q1.3 8.75,67.75 9.56,68.56 R5.1 11.44,68.56 11.5,68.5 v15.75,68.5
GND  (via drill 0.25)
  Bottom 0.25: 19.25,95.75 U1.35 21.25,95.75 | 22.25,90.25 U1.23 22.25,88.25 | 23.75,90.25 U1.20 23.75,88.25 | 27.75,92.75 U1.8 29.75,92.75 | 26.75,98.75 U1.47 | U1.47 26.75,96.75 | U1.46 26.25,96.75 | 26.25,98.75 U1.46 | U1.46 U1.47 | 25.25,98.75 U1.44 25.25,96.75
  other vias: 37.25,0.75 38.75,1.5 20.5,0.75 10,0.75 30,0.75 25.25,0.75 15.25,0.75 5.5,0.75 35.5,0.75 0.75,76 0.75,81 39.25,74.26 39.25,68 0.75,8.25 0.75,11 0.75,16.25 0.75,21 39.25,6 39.25,3.5 3.75,10.25 7.5,0.75 17.25,0.75 22.75,0.75 27.25,0.75 32.5,1 0.75,13.5 0.75,18.5 0.75,23.5 0.75,83.5 0.75,78.5 0.75,73.5 39.25,84 0.75,26 0.75,28.5 0.75,71 0.75,68.5 0.75,66 0.75,63.5 0.75,61 0.75,58.5 0.75,56 0.75,53.5 0.75,51 0.75,48.5 0.75,46 0.75,43.5 0.75,41 0.75,38.5 0.75,36 0.75,33.5 0.75,31 39.25,81.5 39.25,78.5 39.25,76.25 39.25,69.75 39.25,66 39.25,63.5 39.25,61 39.25,58.5 39.25,56 39.25,53.5 39.25,51 39.25,48.5 39.25,46 39.25,43.5 39.25,38.5 39.25,41 39.25,36 39.25,33.5 39.25,31 39.25,28.5 39.25,26 39.25,23.5 39.25,21 39.25,18.5 39.25,16 39.25,13.5 39.25,11 39.25,8.5 28.75,98.75 31.25,99 37.25,99.75 21.5,95.25 23.75,90.5 26,96.5 29,87.25 36.25,86.75 5.5,70.5 8,69.75 13.25,60.5 18.75,58.75 37.5,60 34,58.5 34.75,55.75 37.75,55 6.5,63.75 7.5,60.75 9,62.25 4,62.25 34,61.5 35.5,47 37.75,44 34.25,43.25 32.75,45.5 9.25,35 5.5,31 33.75,31.25 36.75,37 32.5,40.25 7.25,24.5 5.25,25.5 7.5,19.25 5,16.75 8.75,15.25 9.75,18 15,15.75 33.5,12 31.5,10 33.5,14.25 34.75,23 28.75,29 37.5,29.25 29,38 2.5,38 24.75,13 26.25,20.5 29.25,25.25 5,41 27.5,52.75 26,49.5 37.5,89.5 34.75,94 4.75,72.75 28.5,61.5 30.5,61.5 30.25,58.25 26.25,58.75 22.5,54.5 37.5,49 27.75,48 7.5,44.5 6.75,38 9.5,29.5 11,23.75 17.5,10.5 4,14.25 29.25,14.25 37.5,14.25 37.5,19 37.5,21 37.5,9.5 34.5,27 17.5,42.5 16,44.25 24.5,39.5 22.75,42.75 28.25,36 15.75,39.5 16.5,36.75 18.75,40.25 18.5,61.25 13.25,66.75 33.75,93 33.75,95 30.25,93 28,89 22.75,90.5 23,93.5 24.5,92 5.75,53.25 17.25,53.25 0.75,86 0.75,88.5 0.75,91 0.75,93.5 0.75,96 0.75,98.5 0.75,101 0.75,103 39.25,86.75 39.25,88.75 39.25,91 39.25,93.5 39.25,96 39.25,98.5 39.25,101 39.25,103 20,109.75 17.5,109.75 15,109.75 12.5,109.75 10,109.75 7.5,109.75 22.5,109.75 25,109.75 27.5,109.75 30,109.75 32.5,109.75 5.75,109.75 0.75,104.75 34.25,109.75 39.25,104.75 21.5,91.75 3,104 6.5,107.5 5.5,105 33.5,107.5 37,104 34.5,105 9.75,4.5 3.25,6.75 6,6.5 9.5,9 12.75,5 17.25,6 26,10.5 33.75,6.25 12.5,0.75 6.5,2.75 16,26.25 12.75,31.5 17.75,31.5 20.25,33 18.25,34.75 23.5,36.5 27,34 23.5,28.75 27,29.75 27.25,25 19.25,21.5 15.25,21.75 10,20.5 23.75,17.5 19.5,17.5 14.25,23.5 18.25,25.5 21.75,25.75 9.5,38.5 12.5,41 13.25,36.25 13.25,19.75 22,14.25 0.75,5.5 17.75,72.75 16.25,70.25 17.75,69 16.25,74.5 23.75,71 21.25,68 18,63.25 21.25,63 25,66.75 25.25,61.75 24,60.5 24,56.5 9,66.25 12.25,69.5 21.25,72 16.5,95.75 10.75,95.75 9.75,97.25 10.75,94 16.5,94.25 15,92.25 9.25,91.5 4.5,98 4.5,100.5 4.5,95.5 9.75,101.75 6.25,102.25 13.75,101.5 16.25,102 18.75,101.5 21.25,102 25,100.5 23.75,102 19.75,90 18,90 18,85.75 15.25,87 5.75,82.5 7.75,85 13,85 12.75,83.5 9.75,81.25 11.5,81.25 16,83.25 16.25,80.5 16.25,78.5 18.75,79.5 13.25,77 12.25,79 7.75,79.25 2.5,79 3.75,81 7.75,75.75 2.5,75.75 11.5,74.5 13.5,80.5 19.75,88 25.5,85.75 27.25,84 24,83.25 23.75,79.5 22.25,78.75 20,74.75 23.25,75 27.25,75.25 29.25,73.5 29,69.75 28.25,82.75 34.25,76.25 36.75,79.25 34.5,80.75 34.5,84.5 37,84.75 36.25,75.75 35.25,72.5 33.75,70.5 31.25,70.5 31.25,67.25 36.75,68.5 28.5,64.75 26.5,64.75 25.75,69.25 25.25,74 3.5,85.5 7.25,87.75 11,87.5 13,89.5 4.25,88.5 4,91 8,94.5 5.75,93.25 12.5,91.25 3,101.75 13.5,105.5 16.25,105.5 21.25,105.5 23.75,105.5 18.75,105.5 29,101.75 26.75,100 31.75,105.5 32.5,102 37,94 30.75,90 33.25,88.75 31.5,87 31.25,85.5 31.5,72.75
  pour Bottom (isolate 0.25): 0,110.5 40,110.5 40,0 0,0
  pour Top (isolate 0.25): 0,110.5 40,110.5 40,0 0,0
JTCK/SWCLK
  Bottom 0.25: U1.37 20.75,97.75 20,98.5 10,98.5 8.23,96.73 H2.4
JTDI
  Bottom 0.25: U1.38 22.25,98.75 22,99 8.25,99 8,99.25 6.47,99.25 H2.8
JTDO/SWO  (via drill 0.25)
  Top 0.25: v8.5,99.75 v8.5,98.25
  Bottom 0.25: U1.39 22.75,99 22.25,99.5 8.75,99.5 v8.5,99.75 | H2.6 8.25,98 v8.5,98.25
JTMS/SWDIO
  Bottom 0.25: H2.2 8.25,95.46 10.46,93.25 16.61,93.25 18.56,95.2 20.2,95.2 U1.34
N$1  (via drill 0.25)
  Top 0.25: v2.5,18.5 3.25,18.5 v4.75,20 | P6.P$2 17,15.5 v17,17.25
  Bottom 0.25: R27.2 v2.5,18.5 | v4.75,20 5,20.25 8.75,20.25 9.5,19.5 12.25,19.5 14.75,17 16.75,17 v17,17.25
N$3  (via drill 0.25)
  Top 0.25: v28.5,32.25 27.5,32.25 v27,31.75
  Bottom 0.25: U7.13 24.55,38.2 28.25,34.5 28.25,32.5 v28.5,32.25 28.5,32 31,29.5 31,28.5 31.25,28.25 33.25,28.25 33.5,28 33.5,26 33.19,25.69 C24.1 | P4.P$3 19.25,29.25 20.75,29.25 23,31.5 26.75,31.5 v27,31.75 | C24.1 R20.1 30.5,24 30.81,23.69 R25.2 | R22.2 C24.1
N$12
  Bottom 0.25: U8.7 13.55,25.45 12.75,26.25 12.75,30 11.5,31.25 11.5,32 11.31,32.19 R14.1 9.81,32.19 9.69,32.31 R17.2
N$13  (via drill 0.25)
  Top 0.25: P2.P$2 27.25,44.75 v26.25,44.75
  Bottom 0.25: R9.1 14.5,39.75 15.75,41 15.75,42.5 17.25,44 19,44 19.75,44.75 v26.25,44.75
N$14
  Bottom 0.25: R18.1 7,35 3.25,38.75 3.25,40.75 4,41.5 4,42.5 2,44.5 2,56.42 J2.P3
N$29
  Bottom 0.25: U7.2 16.3,38.2 16,38.5 10.44,38.5 | 10.44,38.5 R13.1 C22.1 10.44,34.56 10.5,34.5 R14.2 | R9.2 10.44,38.5
N$45
  Bottom 0.25: U8.6 13.45,24.8 12.25,26 12.25,29.75 11.31,30.69 R17.1 R18.2
N$46
  Bottom 0.25: R10.1 2.44,40.69 2.58,40.83 J3.P3
N$47  (via drill 0.25)
  Top 0.25: v12,24.5 v12,17.25
  Bottom 0.25: v12,24.5 11,25.5 10.25,25.5 9.5,26.25 9.5,28 8.5,29 6.5,29 4.5,27 J4.P3 | R26.1 12,16.81 v12,17.25
N$48  (via drill 0.25)
  Top 0.25: P3.P$2 31.75,35 30.5,33.75 29,33.75 28,32.75 v27,32.75 | v7.75,35 12.25,30.5 v21,30.5
  Bottom 0.25: v7.75,35 4.06,38.69 R10.2 | v21,30.5 21.25,30.5 22.75,32 26.25,32 v27,32.75
N$50  (via drill 0.25)
  Top 0.25: P4.P$1 23.75,26.25 23.75,24.25 25.25,22.75 v25.25,22.5
  Bottom 0.25: U8.13 23.7,22.2 23.75,22.25 25,22.25 v25.25,22.5 26.56,23.81 R23.1
N$51
  Bottom 0.25: U8.14 23.8,21.55 24,21.75 26,21.75 26.44,22.19 R23.2 28.44,22.19 28.5,22.25 R25.1
N$52  (via drill 0.25)
  Top 0.25: v29.75,29 30.75,30 v32.25,30
  Bottom 0.25: v29.75,29 29.75,29.25 28,31 23.25,31 21,28.75 19.5,28.75 18.75,28 18.75,26.75 19.5,26 19.5,23.75 17.95,22.2 U8.2 | v32.25,30 34.25,30 35.06,30.81 R15.1 35.06,33.69 35,33.75 P3.P$1
N$53  (via drill 0.25)
  Top 0.25: v31.5,31.5 30,31.5 v28.25,29.75
  Bottom 0.25: v28.25,29.75 28.25,30 27.75,30.5 23.5,30.5 21.25,28.25 21.25,27 20,25.75 20,23.5 18.05,21.55 U8.1 | v31.5,31.5 31.56,31.56 R16.1 R15.2
N$55
  Bottom 0.25: R12.1 P3.P$3 30,33.75 29.94,33.69 R16.2 | U7.6 18.3,40.8 19,41.5 19,42.5 20.25,43.75 24.5,43.75 25.25,43 25.25,40.75 28.81,37.19 R12.1 | R12.1 C20.1 R11.2
N$57
  Bottom 0.25: R6.1 4.5,70.08 J1.P3
N$58  (via drill 0.25)
  Top 0.25: v26.5,28.75 25.75,28 25.75,25.75 26.5,25 26.5,23.75 28,22.25 28,19.25 29.25,18 v30.5,18
  Bottom 0.25: v30.5,18 31,17.5 31,14.25 30.5,13.75 R29.1 | U8.8 23.95,25.45 24.5,26 24.5,26.81 R19.2 26.44,28.75 v26.5,28.75
N$60
  Bottom 0.25: R27.1 2.5,13.25 2.58,13.17 J5.P3
N$61
  Bottom 0.25: P5.P$2 R22.1
N$62  (via drill 0.25)
  Top 0.25: P4.P$2 20.75,26.75 20.75,14.75 v20.5,14.5
  Bottom 0.25: v20.5,14.5 14.25,14.5 14.19,14.44 R26.2
N$63  (via drill 0.25)
  Top 0.25: v21.5,24.75 21.25,24.5 21.25,13.75 P6.P$1
  Bottom 0.25: v21.5,24.75 21.55,24.8 U8.9 24.3,24.8 24.75,25.25 24.75,25.44 R19.1
N$65
  Bottom 0.25: P7.P$2 R30.1
N$66
  Bottom 0.25: R6.2 5.31,66.94 5.45,66.8 Q1.1
N$67
  Bottom 0.25: 9.25,21.25 9.57,21.57 U9.7 | 9.25,21.25 8.75,20.75 C27.2 3.75,20.75 3.75,16.25 5,15 5,8.75 5.45,8.3 C32.C | U9.6 8.93,21.57 9.25,21.25
N$68
  Bottom 0.25: C32.A 8.95,4.7 9.5,5.25 9.5,6.25 9.94,6.69 R33.2
N$69
  Bottom 0.25: U9.5 8.28,21.52 8,21.25 6.69,21.25 C25.1 4.56,22.44 4.5,22.5 R24.1
N$70  (via drill 0.25)
  Top 0.25: v22,33.25 24.75,30.5 24.75,24.75 27.5,22 v27.5,18.75 27.75,18.75 29,17.5 30,17.5 30.25,17.25 30.75,17.25 v31.5,18
  Bottom 0.25: R30.2 R28.1 | R28.1 C30.1 | R28.1 31.5,11.19 | R29.2 31.5,11.19 | 31.5,11.19 v31.5,18 | v22,33.25 22.25,33.5 22.25,36.5 21.75,37 21.75,40.5 22.05,40.8 U7.9 | P6.P$3 18.75,11.25 23,11.25 23.75,12 23.75,14.25 27.25,17.75 27.25,18.5 v27.5,18.75
N$71
  Bottom 0.25: C27.1 R24.2 R21.1
N$72
  Bottom 0.25: R32.1 R31.1 14.5,5.5 15.08,4.92 J6.P3
N$73
  Bottom 0.25: U9.1 10.22,14.53 12.25,12.5 12.25,11.25 12.69,10.81 C31.2 14,10 14.5,9.5 R31.2
N$75
  Bottom 0.25: U9.2 9.57,10.43 10,10 C31.1 11.06,9.31 11,9.25 R33.1 R32.2
PARAM1_CV  (via drill 0.25)
  Top 0.25: v31.5,27.25 38.5,34.25 38.5,41.25 38.75,41.5 38.75,42.5 38.5,42.75 38.5,56.25 38.75,56.5 38.75,57.5 38.5,57.75 38.5,62.25 v37.75,63
  Bottom 0.25: v37.75,63 37.75,65.75 35.2,68.3 U4.1 | U7.14 24.45,37.55 27.75,34.25 27.75,32 30.5,29.25 R20.2 31.44,27.31 v31.5,27.25 31.56,27.31 C24.2
PARAM2_CV  (via drill 0.25)
  Top 0.25: v21.25,32.5 22,32.5 24.25,30.25 24.25,24.5 27,21.75 27,19.25 26.75,19 26.75,18.5 27.25,18 27.75,18 28.75,17 29.75,17 30,16.75 31,16.75 31.5,17.25 31.75,17.25 v32.5,18 | v32.75,56.25 30,53.5 24.5,53.5 20,49 20,41.5 v21,40.5
  Bottom 0.25: v32.75,56.25 32.75,61.5 33.5,62.25 36,62.25 37.25,63.5 37.25,65.5 34.55,68.2 U4.2 | v32.5,18 32,17.5 32,14.25 32.5,13.75 R28.2 C30.2 | v21.25,32.5 21.25,33.5 21.75,34 21.75,36.25 21.25,36.75 21.25,40.25 v21,40.5 21.95,41.45 U7.8
PD0-XTAL
  Bottom 0.25: U1.5 34,94.25 34.44,94.69 34.44,97.25 | X1.2 34.44,97.25 | 34.44,97.25 C1.2
PD1-XTAL
  Bottom 0.25: U1.6 34,93.75 34.44,93.31 34.44,90.75 | X1.1 34.44,90.75 | C7.2 34.44,90.75
PITCH_CV  (via drill 0.25)
  Top 0.25: v32,56.75 32,56.25 29.75,54 24.25,54 19.5,49.25 19.5,38.75 v18.75,38
  Bottom 0.25: v32,56.75 32.25,57 32.25,61.75 33.25,62.75 35.75,62.75 36.75,63.75 36.75,65.25 33.9,68.1 U4.3 | v18.75,38 18.3,37.55 U7.1 16.3,37.55 16,37.25 R13.2 C22.2
RESET  (via drill 0.25)
  Top 0.25: v24.5,95.25 22.5,97.25 v10.75,97.25 9.75,98.25 v9.75,100.5
  Bottom 0.25: v24.5,95.25 26.5,93.25 U1.7 | R1.2 C4.1 11.04,96.56 10.75,96.85 v10.75,97.25 | v9.75,100.5 9.71,100.54 H2.10
RX
  Bottom 0.25: R2.2 4.75,90.25 4.25,89.75 2.52,89.75 H3.1
RX_R
  Bottom 0.25: U1.31 17.75,93.75 14.25,90.25 R2.1
TX
  Bottom 0.25: R3.2 5.44,88.5 4.17,87.23 H3.2
TX_R
  Bottom 0.25: U1.30 18,93.25 13.25,88.5 R3.1

### Text on the board
tPlace: µBraids SE / Main Board / TD-UBSE-F-MB / CC BY-SA 4.0 / 2020-02-07 / tall-dog.com
bPlace: Board derived from work by Émilie Gillet of Mutable / Instruments, Magpie Modular, and Neutron Sound | SWD/JTAG | RX | TX | POWER | tall-dog.com | 2020-02-07 | TD-UBSE-F-MB | µBraids SE | MAIN BOARD